# Altium schematic sheet 04. MCU + ANALOG.SchDoc
size A2
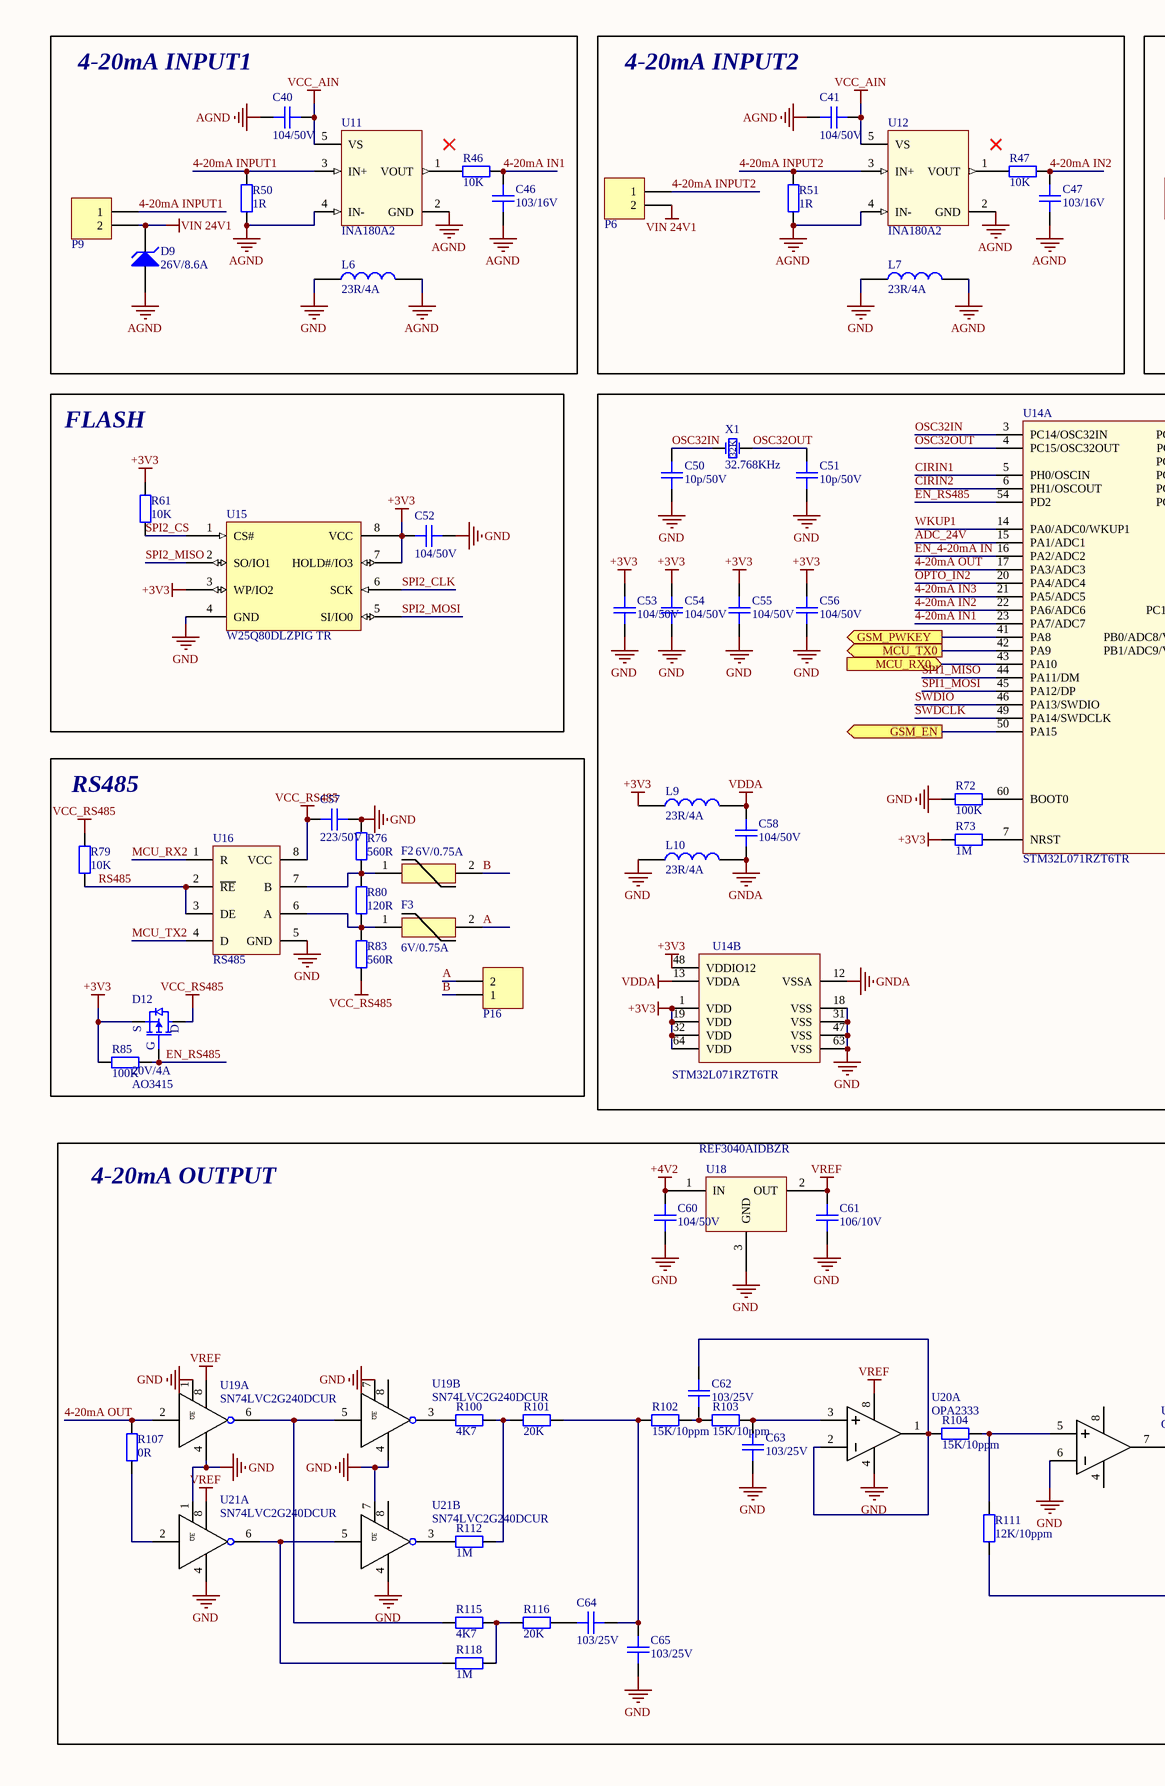
[diagram p0: 04. MCU + ANALOG.SchDoc, left]
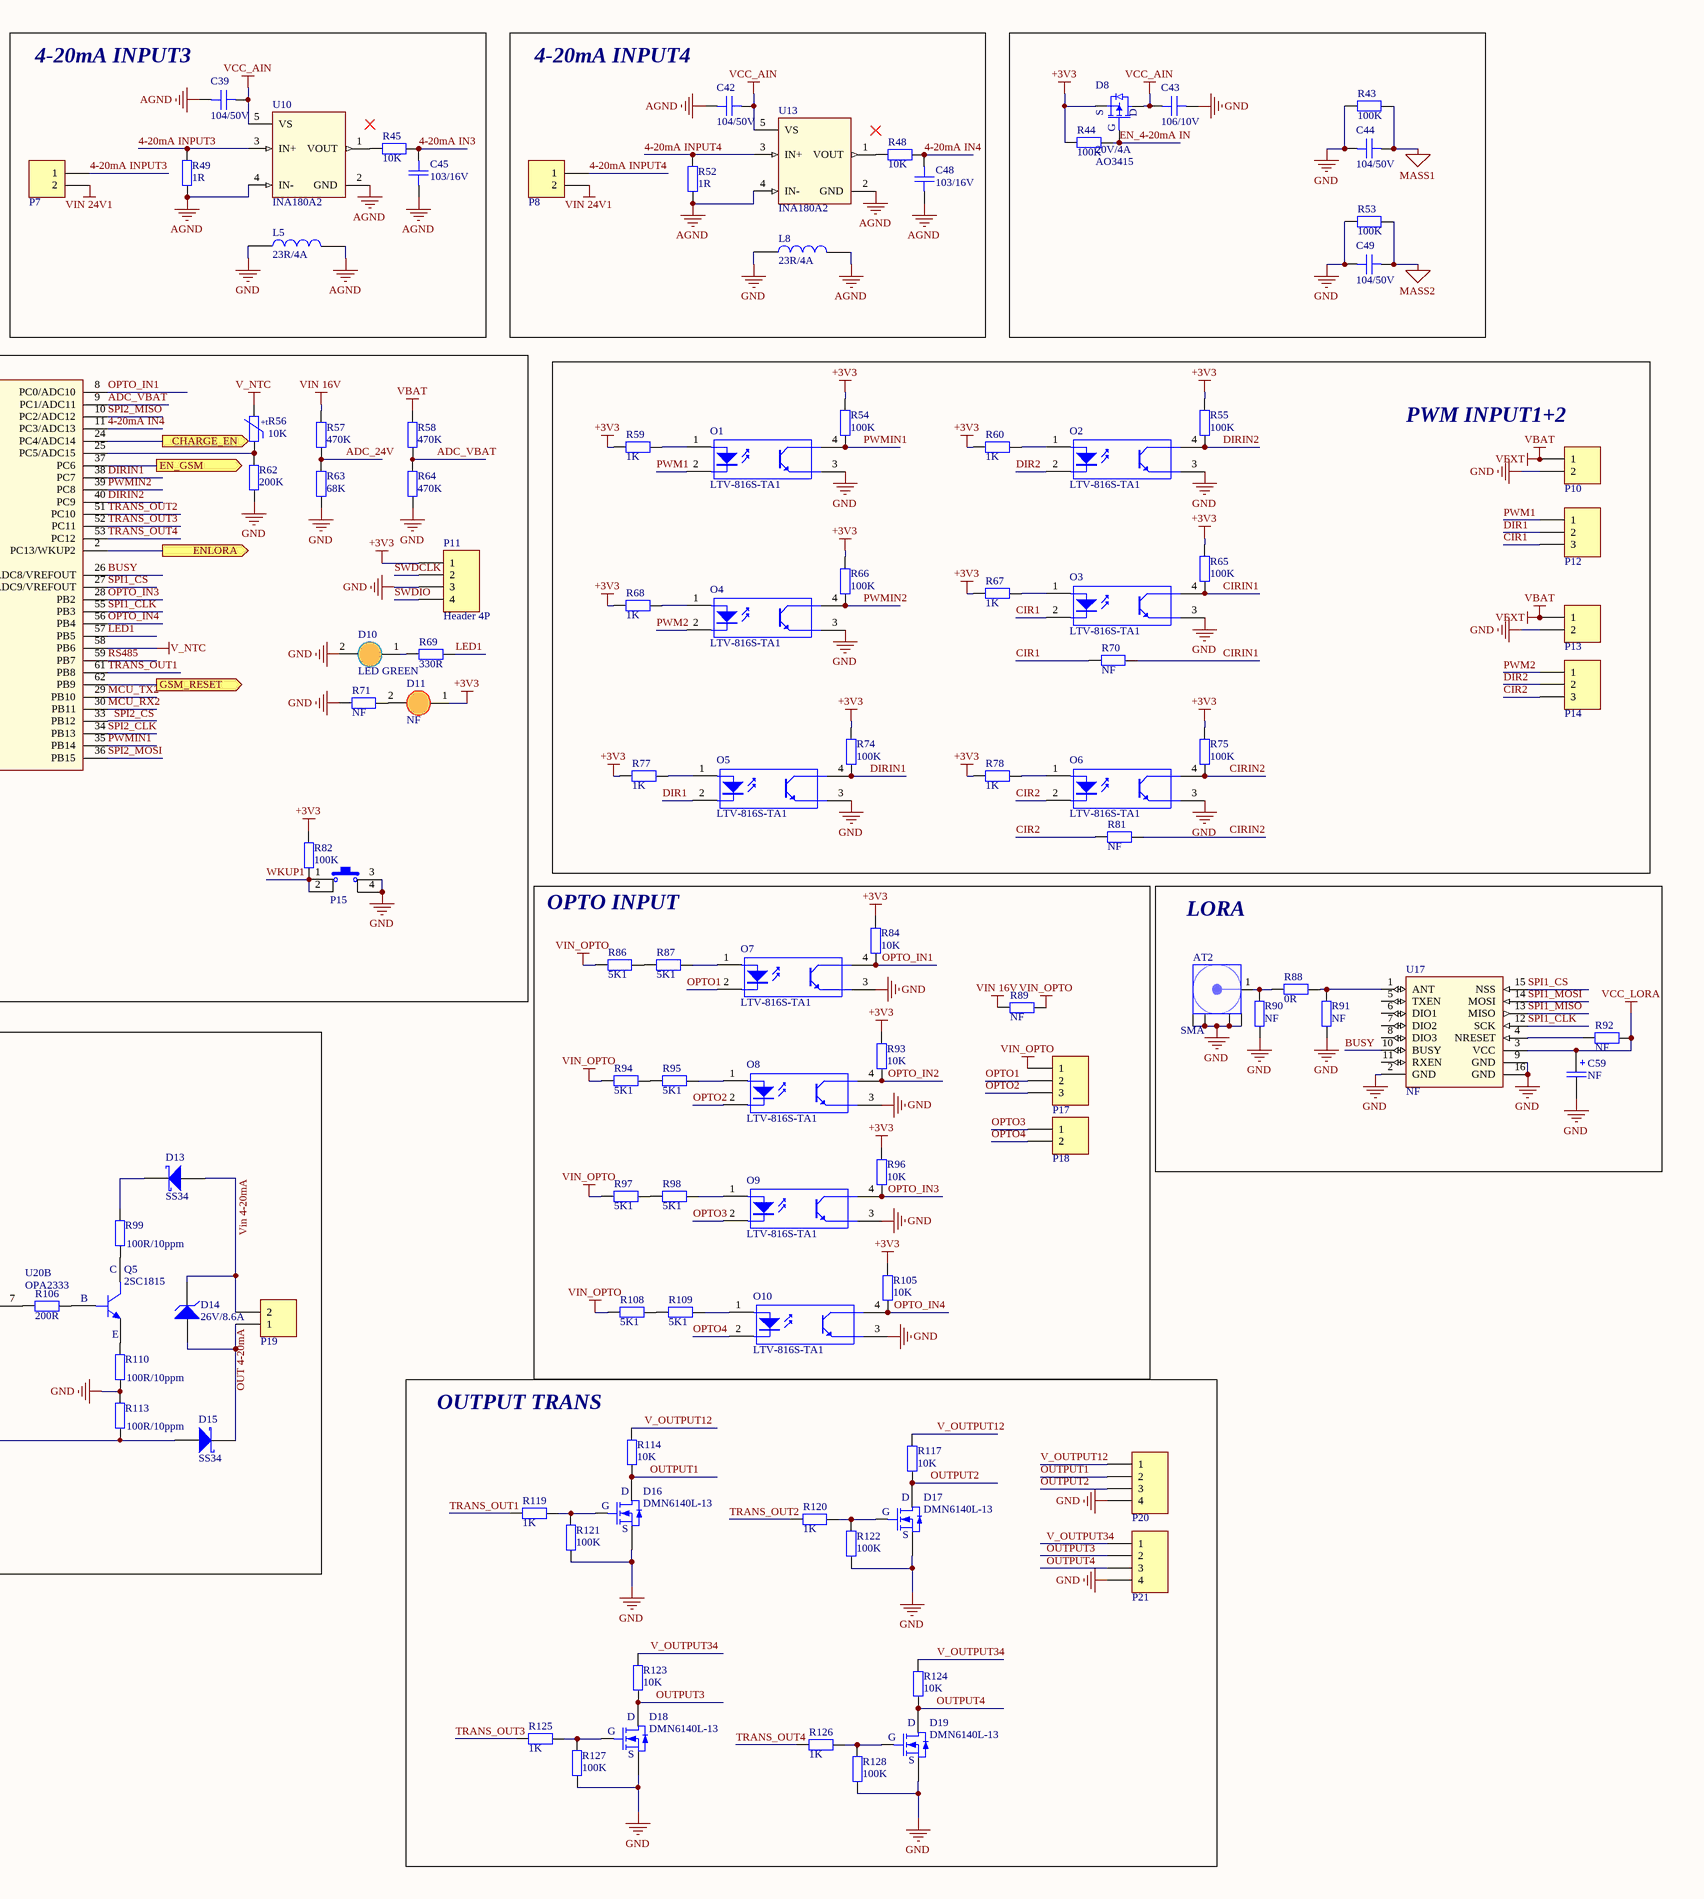
[diagram p1: 04. MCU + ANALOG.SchDoc, right]

## Parts
AT2  SMA  [SMA-KWE-17-V1]
C39  104/50V  [CAPC-0603 (1608)]
C40  104/50V  [CAPC-0603 (1608)]
C41  104/50V  [CAPC-0603 (1608)]
C42  104/50V  [CAPC-0603 (1608)]
C43  106/10V  [CAPC-0603 (1608)]
C44  104/50V  [CAPC-0603 (1608)]
C45  103/16V  [CAPC-0603 (1608)]
C46  103/16V  [CAPC-0603 (1608)]
C47  103/16V  [CAPC-0603 (1608)]
C48  103/16V  [CAPC-0603 (1608)]
C49  104/50V  [CAPC-0603 (1608)]
C50  10p/50V  [CAPC-0603 (1608)]
C51  10p/50V  [CAPC-0603 (1608)]
C52  104/50V  [CAPC-0603 (1608)]
C53  104/50V  [CAPC-0603 (1608)]
C54  104/50V  [CAPC-0603 (1608)]
C55  104/50V  [CAPC-0603 (1608)]
C56  104/50V  [CAPC-0603 (1608)]
C57  223/50V  [CAPC-0603 (1608)]
C58  104/50V  [CAPC-0603 (1608)]
C59  NF  [CAP_TANTAL_1210(3528)]
C60  104/50V  [CAPC-0603 (1608)]
C61  106/10V  [CAPC-0603 (1608)]
C62  103/25V  [CAPC-0603 (1608)]
C63  103/25V  [CAPC-0603 (1608)]
C64  103/25V  [CAPC-0603 (1608)]
C65  103/25V  [CAPC-0603 (1608)]
D8  20V/4A  [SOT23_3]
D9  26V/8.6A  [DIODE_DO214AC_SMA]
D10  LED GREEN  [LED_3MM-GREEN]
D11  NF  [LED_3MM-RED]
D12  20V/4A  [SOT23_3]
D13  SS34  [DIODE_DO214AC_SMA]
D14  26V/8.6A  [DIODE_DO214AC_SMA]
D15  SS34  [DIODE_DO214AC_SMA]
D16  DMN6140L-13  [SOT23_3]
D17  DMN6140L-13  [SOT23_3]
D18  DMN6140L-13  [SOT23_3]
D19  DMN6140L-13  [SOT23_3]
F2  6V/0.75A  [FUSE 0ZCK_BEL]
F3  6V/0.75A  [FUSE 0ZCK_BEL]
L5  23R/4A  [IND-0603 (1608)]
L6  23R/4A  [IND-0603 (1608)]
L7  23R/4A  [IND-0603 (1608)]
L8  23R/4A  [IND-0603 (1608)]
L9  23R/4A  [IND-0603 (1608)]
L10  23R/4A  [IND-0603 (1608)]
O1  LTV-816S-TA1  [OPTO 1]
O2  LTV-816S-TA1  [OPTO 1]
O3  LTV-816S-TA1  [OPTO 1]
O4  LTV-816S-TA1  [OPTO 1]
O5  LTV-816S-TA1  [OPTO 1]
O6  LTV-816S-TA1  [OPTO 1]
O7  LTV-816S-TA1  [OPTO 1]
O8  LTV-816S-TA1  [OPTO 1]
O9  LTV-816S-TA1  [OPTO 1]
O10  LTV-816S-TA1  [OPTO 1]
P6  15EDG3.81-2P  [HDR_3.81MM_RA_2x1]  (value not drawn)
P7  15EDG3.81-2P  [HDR_3.81MM_RA_2x1]  (value not drawn)
P8  15EDG3.81-2P  [HDR_3.81MM_RA_2x1]  (value not drawn)
P9  15EDG3.81-2P  [HDR_3.81MM_RA_2x1]  (value not drawn)
P10  15EDG3.81-2P  [HDR_3.81MM_RA_2x1]  (value not drawn)
P11  Header 4P  [HDR1X4]
P12  15EDG3.81-3P  [HDR_3.81MM_RA_3x1]  (value not drawn)
P13  15EDG3.81-2P  [HDR_3.81MM_RA_2x1]  (value not drawn)
P14  15EDG3.81-3P  [HDR_3.81MM_RA_3x1]  (value not drawn)
P15  (no value)  [BUTTON 4P_6X6]
P16  15EDG3.81-2P  [HDR_3.81MM_RA_2x1]  (value not drawn)
P17  15EDG3.81-3P  [HDR_3.81MM_RA_3x1]  (value not drawn)
P18  15EDG3.81-2P  [HDR_3.81MM_RA_2x1]  (value not drawn)
P19  15EDG3.81-2P  [HDR_3.81MM_RA_2x1]  (value not drawn)
P20  15EDG3.81-4P  [HDR_3.81MM_RA_4X1]  (value not drawn)
P21  15EDG3.81-4P  [HDR_3.81MM_RA_4X1]  (value not drawn)
Q5  2SC1815  [SOT23_3]
R43  100K  [RESC-0603 (1608)]
R44  100K  [RESC-0603 (1608)]
R45  10K  [RESC-0603 (1608)]
R46  10K  [RESC-0603 (1608)]
R47  10K  [RESC-0603 (1608)]
R48  10K  [RESC-0603 (1608)]
R49  1R  [RESC-0603 (1608)]
R50  1R  [RESC-0603 (1608)]
R51  1R  [RESC-0603 (1608)]
R52  1R  [RESC-0603 (1608)]
R53  100K  [RESC-0603 (1608)]
R54  100K  [RESC-0603 (1608)]
R55  100K  [RESC-0603 (1608)]
R56  10K  [RES NTC 10K]
R57  470K  [RESC-0603 (1608)]
R58  470K  [RESC-0603 (1608)]
R59  1K  [RESC-0603 (1608)]
R60  1K  [RESC-0603 (1608)]
R61  10K  [RESC-0603 (1608)]
R62  200K  [RESC-0603 (1608)]
R63  68K  [RESC-0603 (1608)]
R64  470K  [RESC-0603 (1608)]
R65  100K  [RESC-0603 (1608)]
R66  100K  [RESC-0603 (1608)]
R67  1K  [RESC-0603 (1608)]
R68  1K  [RESC-0603 (1608)]
R69  330R  [RESC-0603 (1608)]
R70  NF  [RESC-0603 (1608)]
R71  NF  [RESC-0603 (1608)]
R72  100K  [RESC-0603 (1608)]
R73  1M  [RESC-0603 (1608)]
R74  100K  [RESC-0603 (1608)]
R75  100K  [RESC-0603 (1608)]
R76  560R  [RESC-0603 (1608)]
R77  1K  [RESC-0603 (1608)]
R78  1K  [RESC-0603 (1608)]
R79  10K  [RESC-0603 (1608)]
R80  120R  [RESC-0603 (1608)]
R81  NF  [RESC-0603 (1608)]
R82  100K  [RESC-0603 (1608)]
R83  560R  [RESC-0603 (1608)]
R84  10K  [RESC-0603 (1608)]
R85  100K  [RESC-0603 (1608)]
R86  5K1  [RESC-0603 (1608)]
R87  5K1  [RESC-0603 (1608)]
R88  0R  [RESC-0603 (1608)]
R89  NF  [RESC-0603 (1608)]
R90  NF  [RESC-0603 (1608)]
R91  NF  [RESC-0603 (1608)]
R92  NF  [RESC-0603 (1608)]
R93  10K  [RESC-0603 (1608)]
R94  5K1  [RESC-0603 (1608)]
R95  5K1  [RESC-0603 (1608)]
R96  10K  [RESC-0603 (1608)]
R97  5K1  [RESC-0603 (1608)]
R98  5K1  [RESC-0603 (1608)]
R99  100R/10ppm  [RESC-0805 (2012)]
R100  4K7  [RESC-0603 (1608)]
R101  20K  [RESC-0603 (1608)]
R102  15K/10ppm  [RESC-0603 (1608)]
R103  15K/10ppm  [RESC-0603 (1608)]
R104  15K/10ppm  [RESC-0603 (1608)]
R105  10K  [RESC-0603 (1608)]
R106  200R  [RESC-0603 (1608)]
R107  0R  [RESC-0603 (1608)]
R108  5K1  [RESC-0603 (1608)]
R109  5K1  [RESC-0603 (1608)]
R110  100R/10ppm  [RESC-0805 (2012)]
R111  12K/10ppm  [RESC-0603 (1608)]
R112  1M  [RESC-0603 (1608)]
R113  100R/10ppm  [RESC-0805 (2012)]
R114  10K  [RESC-0603 (1608)]
R115  4K7  [RESC-0603 (1608)]
R116  20K  [RESC-0603 (1608)]
R117  10K  [RESC-0603 (1608)]
R118  1M  [RESC-0603 (1608)]
R119  1K  [RESC-0603 (1608)]
R120  1K  [RESC-0603 (1608)]
R121  100K  [RESC-0603 (1608)]
R122  100K  [RESC-0603 (1608)]
R123  10K  [RESC-0603 (1608)]
R124  10K  [RESC-0603 (1608)]
R125  1K  [RESC-0603 (1608)]
R126  1K  [RESC-0603 (1608)]
R127  100K  [RESC-0603 (1608)]
R128  100K  [RESC-0603 (1608)]
U10  INA180A2  [SOT23-5]
U11  INA180A2  [SOT23-5]
U12  INA180A2  [SOT23-5]
U13  INA180A2  [SOT23-5]
U14  STM32L071RZT6TR  [LQFP-64]  (parts A,B of 2)
U15  W25Q80DLZPIG TR  [WSON-8 6X5MM]
U16  RS485  [SOIC8]
U17  NF  [Lora1276 V1.2]
U18  REF3040AIDBZR  [SOT23_3]
U19  SN74LVC2G240DCUR  [SN74LVC2G240DCUR]  (parts A,B of 2)
U20  OPA2333  [8VSSOP]  (parts A,B of 2)
U21  SN74LVC2G240DCUR  [SN74LVC2G240DCUR]  (parts A,B of 2)
X1  32.768KHz  [CRYSTAL_ABS06 2x1.2mm]

## Blocks framed on the sheet
4-20mA INPUT1: C40 C46 D9 L6 P9 R46 R50 U11
4-20mA INPUT2: C41 C47 L7 P6 R47 R51 U12
4-20mA INPUT3: C39 C45 L5 P7 R45 R49 U10
4-20mA INPUT4: C42 C48 L8 P8 R48 R52 U13
FLASH: C52 R61 U15
PWM INPUT1+2: O1-O6 P10 P12-P14 R54 R55 R59 R60 R65-R68 R70 R74 R75 R77 R78 R81
RS485: C57 D12 F2 F3 P16 R76 R79 R80 R83 R85 U16
OPTO INPUT: O7-O10 P17 P18 R84 R86 R87 R89 R93-R98 R105 R108 R109
LORA: AT2 C59 R88 R90-R92 U17
4-20mA OUTPUT: C60-C65 D13-D15 P19 Q5 R99-R104 R106 R107 R110-R113 R115 R116 R118 U18-U21
OUTPUT TRANS: D16-D19 P20 P21 R114 R117 R119-R128

## Ports
CHARGE_EN (out), EN_GSM (out), ENLORA (out), GSM_EN (out), GSM_PWKEY (out), GSM_RESET (out), MCU_RX0 (in), MCU_TX0 (out)

## Nets
+3V3: C52.2 C53.2 C54.2 C55.2 C56.2 D8.2(S) D11.1(A) D12.2(S) L9.1 P11.1 R44.2 R54.2 R55.2 R59.1 R60.1 R61.1 R65.2 R66.2 R67.1 R68.1 R73.1 R74.2 R75.2 R77.1 R78.1 R82.2 R84.2 R85.2 R93.2 R96.2 R105.2 U14.1(VDD) U14.19(VDD) U14.32(VDD) U14.48(VDDIO12) U14.64(VDD) U15.3(WP/IO2) U15.7(HOLD#/IO3) U15.8(VCC)
+4V2: C60.2 U18.1(IN)
AGND: C39.2 C40.2 C41.2 C42.2 C45.1 C46.1 C47.1 C48.1 D9.1(A) L5.2 L6.2 L7.2 L8.2 R49.1 R50.1 R51.1 R52.1 U10.2(GND) U10.4(IN-) U11.2(GND) U11.4(IN-) U12.2(GND) U12.4(IN-) U13.2(GND) U13.4(IN-)
GND: AT2.2 C43.2 C44.1 C49.1 C50.1 C51.1 C52.1 C53.1 C54.1 C55.1 C56.1 C57.2 C59.2 C60.1 C61.2 C63.2 C65.2 D10.2(K) D16.2(S) D17.2(S) D18.2(S) D19.2(S) L5.1 L6.1 L7.1 L8.1 L10.1 O1.3 O2.3 O3.3 O4.3 O5.3 O6.3 O7.3 O8.3 O9.3 O10.3 P10.2 P11.3 P13.2 P15.3 P15.4 P20.4 P21.4 R43.1 R53.1 R62.1 R63.1 R64.1 R71.1 R72.1 R76.2 R90.1 R91.1 R110.1 R113.2 R121.1 R122.1 R127.1 R128.1 U14.18(VSS) U14.31(VSS) U14.47(VSS) U14.63(VSS) U15.4(GND) U16.5(GND) U17.2(GND) U17.9(GND) U17.16(GND) U18.3(GND) U19.1(~{OE}) U19.4(GND) U19.7(~{OE}) U20.4(VSS) U20.6(IN-) U21.1(~{OE}) U21.4(GND) U21.7(~{OE})
GNDA: C58.1 L10.2 U14.12(VSSA)
MASS1: C44.2 R43.2
MASS2: C49.2 R53.2
V_NTC: R56.2 U14.58(PB6)
VBAT: P10.1 P13.1 R58.2  [also labelled VEXT]
VCC_AIN: C39.1 C40.1 C41.1 C42.1 C43.1 D8.3(D) U10.5(VS) U11.5(VS) U12.5(VS) U13.5(VS)
VCC_LORA: C59.1 R92.2 U17.3(VCC)
VCC_RS485: C57.1 D12.3(D) R79.2 R83.1 U16.8(VCC)
VDDA: C58.2 L9.2 U14.13(VDDA)
VIN 16V: R57.2 R89.1
VIN 24V1: D9.2(K) P6.2 P7.2 P8.2 P9.2
VIN_OPTO: P17.1 R86.1 R89.2 R94.1 R97.1 R108.1
VREF: C61.1 U18.2(OUT) U19.8(VCC) U20.8(VCC) U21.8(VCC)
4-20mA IN1: C46.2 R46.1 U14.23(PA7/ADC7)
4-20mA IN2: C47.2 R47.1 U14.22(PA6/ADC6)
4-20mA IN3: C45.2 R45.1 U14.21(PA5/ADC5)
4-20mA IN4: C48.2 R48.1 U14.11(PC3/ADC13)
4-20mA INPUT1: P9.1 R50.2 U11.3(IN+)
4-20mA INPUT2: P6.1 R51.2 U12.3(IN+)
4-20mA INPUT3: P7.1 R49.2 U10.3(IN+)
4-20mA INPUT4: P8.1 R52.2 U13.3(IN+)
4-20mA OUT: R107.2 U14.17(PA3/ADC3) U19.2(A)
A: F3.2 P16.2
ADC_24V: R57.1 R63.2 U14.15(PA1/ADC1)
ADC_VBAT: R58.1 R64.2 U14.9(PC1/ADC11)
B: F2.2 P16.1
BUSY: U14.26(PB0/ADC8/VREFOUT) U17.10(BUSY)
CHARGE_EN: U14.24(PC4/ADC14) ; port CHARGE_EN
CIR1: O3.2 P12.3 R70.1
CIR2: O6.2 P14.3 R81.1
CIRIN1: O3.4 R65.1 R70.2 U14.5(PH0/OSCIN)
CIRIN2: O6.4 R75.1 R81.2 U14.6(PH1/OSCOUT)
DIR1: O5.2 P12.2
DIR2: O2.2 P14.2
DIRIN1: O5.4 R74.1 U14.38(PC7)
DIRIN2: O2.4 R55.1 U14.40(PC9)
EN_4-20mA IN: D8.1(G) R44.1 U14.16(PA2/ADC2)
EN_GSM: U14.37(PC6) ; port EN_GSM
EN_RS485: D12.1(G) R85.1 U14.54(PD2)
ENLORA: U14.2(PC13/WKUP2) ; port ENLORA
GSM_EN: U14.50(PA15) ; port GSM_EN
GSM_PWKEY: U14.41(PA8) ; port GSM_PWKEY
GSM_RESET: U14.62(PB9) ; port GSM_RESET
LED1: R69.2 U14.57(PB5)
MCU_RX0: U14.43(PA10) ; port MCU_RX0
MCU_RX2: U14.30(PB11) U16.1(R)
MCU_TX0: U14.42(PA9) ; port MCU_TX0
MCU_TX2: U14.29(PB10) U16.4(D)
OPTO1: O7.2 P17.2
OPTO2: O8.2 P17.3
OPTO3: O9.2 P18.1
OPTO4: O10.2 P18.2
OPTO_IN1: O7.4 R84.1 U14.8(PC0/ADC10)
OPTO_IN2: O8.4 R93.1 U14.20(PA4/ADC4)
OPTO_IN3: O9.4 R96.1 U14.28(PB2)
OPTO_IN4: O10.4 R105.1 U14.56(PB4)
OSC32IN: C50.2 U14.3(PC14/OSC32IN) X1.1(OSC1)
OSC32OUT: C51.2 U14.4(PC15/OSC32OUT) X1.2(OSC2)
OUTPUT1: D16.3(D) P20.2 R114.1
OUTPUT2: D17.3(D) P20.3 R117.1
OUTPUT3: D18.3(D) P21.2 R123.1
OUTPUT4: D19.3(D) P21.3 R124.1
PWM1: O1.2 P12.1
PWM2: O4.2 P14.1
PWMIN1: O1.4 R54.1 U14.35(PB14)
PWMIN2: O4.4 R66.1 U14.39(PC8)
RS485: R79.1 U14.59(PB7) U16.2(~{RE}) U16.3(DE)
SPI1_CLK: U14.55(PB3) U17.12(SCK)
SPI1_CS: U14.27(PB1/ADC9/VREFOUT) U17.15(NSS)
SPI1_MISO: U14.44(PA11/DM) U17.13(MISO)
SPI1_MOSI: U14.45(PA12/DP) U17.14(MOSI)
SPI2_CLK: U14.34(PB13) U15.6(SCK)
SPI2_CS: R61.2 U14.33(PB12) U15.1(CS#)
SPI2_MISO: U14.10(PC2/ADC12) U15.2(SO/IO1)
SPI2_MOSI: U14.36(PB15) U15.5(SI/IO0)
SWDCLK: P11.2 U14.49(PA14/SWDCLK)
SWDIO: P11.4 U14.46(PA13/SWDIO)
TRANS_OUT1: R119.1 U14.61(PB8)
TRANS_OUT2: R120.1 U14.51(PC10)
TRANS_OUT3: R125.1 U14.52(PC11)
TRANS_OUT4: R126.1 U14.53(PC12)
V_OUTPUT12: P20.1 R114.2 R117.2
V_OUTPUT34: P21.1 R123.2 R124.2
Vin 4-20mA: D13.1(A) D14.2(K) P19.2
WKUP1: P15.1 P15.2 R82.1 U14.14(PA0/ADC0/WKUP1)
NetAT2_1: AT2.1(Signal) R88.2 R90.2
NetC62_1: C62.1 R102.2 R103.1
NetC62_2: C62.2 R104.1 U20.1(OUT) U20.2(IN-)
NetC63_1: C63.1 R103.2 U20.3(IN+)
NetC64_1: C64.1 C65.1 R101.2 R102.1
NetC64_2: C64.2 R116.2
NetD10_1: D10.1(A) R69.1
NetD11_2: D11.2(K) R71.2
NetD13_2: D13.2(K) R99.2
NetD14_1: D14.1(A) D15.2(K) P19.1
NetD15_1: D15.1(A) R111.1 R113.1
NetD16_1: D16.1(G) R119.2 R121.2
NetD17_1: D17.1(G) R120.2 R122.2
NetD18_1: D18.1(G) R125.2 R127.2
NetD19_1: D19.1(G) R126.2 R128.2
NetF2_1: F2.1 R76.1 R80.2 U16.7(B)
NetF3_1: F3.1 R80.1 R83.2 U16.6(A)
NetO1_1: O1.1 R59.2
NetO2_1: O2.1 R60.2
NetO3_1: O3.1 R67.2
NetO4_1: O4.1 R68.2
NetO5_1: O5.1 R77.2
NetO6_1: O6.1 R78.2
NetO7_1: O7.1 R87.2
NetO8_1: O8.1 R95.2
NetO9_1: O9.1 R98.2
NetO10_1: O10.1 R109.2
NetQ5_1: Q5.1(B) R106.2
NetQ5_2: Q5.2(E) R110.2
NetQ5_3: Q5.3(C) R99.1
NetR45_2: R45.2 U10.1(VOUT)
NetR46_2: R46.2 U11.1(VOUT)
NetR47_2: R47.2 U12.1(VOUT)
NetR48_2: R48.2 U13.1(VOUT)
NetR56_1: R56.1 R62.2 U14.25(PC5/ADC15)
NetR72_2: R72.2 U14.60(BOOT0)
NetR73_2: R73.2 U14.7(NRST)
NetR86_2: R86.2 R87.1
NetR88_1: R88.1 R91.2 U17.1(ANT)
NetR92_1: R92.1 U17.4(NRESET)
NetR94_2: R94.2 R95.1
NetR97_2: R97.2 R98.1
NetR100_1: R100.1 U19.3(Y)
NetR100_2: R100.2 R101.1 R112.2
NetR104_2: R104.2 R111.2 U20.5(IN+)
NetR106_1: R106.1 U20.7(OUT)
NetR107_1: R107.1 U21.2(A)
NetR108_2: R108.2 R109.1
NetR112_1: R112.1 U21.3(Y)
NetR115_1: R115.1 U19.5(A) U19.6(Y)
NetR115_2: R115.2 R116.1 R118.2
NetR118_1: R118.1 U21.5(A) U21.6(Y)

Not connected (* = marked no-connect by the designer): U17 5(TXEN) 6(DIO1) 7(DIO2) 8(DIO3) 11(RXEN)

## Notes on the sheet
- Labels drawn without touching a wire or pin: OUT 4-20mA
- File:
- Project:
- REV:
- Sheet:
- Drawn By:
- Size:
- A2
- DRAFT
- Checked By:
- Approved By:
- (in symbol 01M1002JF) +t
- (in symbol ABS06-107-32.768kHz-T) 32K

## Library data of the parts
AT2 = GKZS-SMAJZM-KWE-17.3: MFR: GAOKE; Solder: WAVE; MPN: GKZS-SMAJZM-KWE-17.3; Value: SMA
C39-C42 C44 C49 C52-C56 C58 C60 = C0603C104K5RACTU: CAP CER 0.1uF 50V 10% X7R 0603; Solder: SMT; Company ID: VT00574; MPN: C0603C104K5RACTU; Value: 104/50V
C43 C61 = CL10A106KP8NNNC: CAP CER 10uF 10% 10V X5R 0603; Solder: SMT; MPN: CL10A106KP8NNNC; Value: 106/10V
C45-C48 = CC0603KRX7R7BB103: CAP CER 10nF 16V 10% X7R 0603; Solder: SMT; Company ID: VT00031; MPN: CC0603KRX7R7BB103; Value: 103/16V
C50 C51 = CL10C100JB8NNND: CAP CER 10pF 5% 50V NP0 0603; Solder: SMT; Company ID: VT00076; Value: 10p/50V; MPN: CL10C100JB8NNND
C57 = CC0603JRX7R9BB223: CAP CER 0.022uF 5% 50V X7R 0603; Solder: SMT; MPN: CC0603JRX7R9BB223; Value: 223/50V
C59 = T520B227M006ATE035: CAP TANT POLY 220uF 20% 6.3V 3528 35mOhm ESR; Solder: SMT; Value: 227/6.3V; Company ID: VT00099; MPN: T520B227M006ATE035
C62-C65 = GMC10CG103J25NT: CAP CER 0.01UF 25V C0G/NP0 0603; MFR: CAL-CHIP ELECTRONICS, INC.; MPN: GMC10CG103J25NT; Solder: Cap-0603; Value: 103/25V; Category: Capacitor; Company ID: *
D8 D12 = AO3415: MOSFET P-CH 20V 4A SOT23; MFR: Alpha & Omega Semiconductor Inc.; Company ID: VT00490; CATEGORY: DIODE; SOLDER: SOT23; VALUE: 20V/4A; MPN: AO3415
D9 D14 = P4SMAJ26: TVS DIODE 26VWM 46.6VC SMA/DO214; MFR: Diotec Semiconductor; Solder: SMT; Value: 26V/8.6A; MPN: P4SMAJ26; Category: Diode
D10 = OVLBG4C7: LED GREEN CLEAR 3MM ROUND T/H; Solder: WAVE; MPN: OVLBG4C7; Value: LED GREEN
D11 = WP710A10SRC/E: LED RED CLEAR 3MM ROUND T/H; Solder: WAVE; Value: LED RED; MPN: WP710A10SRC/E
D13 D15 = SS34: DIODE SCHOTTKY 40V 3A SMA; MFR: onsemi; Solder: SMT; Company ID: VT00542; MPN: SS34; Value: SS34
D16-D19 = DMN6140L-13: MOSFET N-CH 60V 1.6A SOT23; MFR: Diodes Incorporated; Company ID: VT00176; MPN: DMN6140L-13; Category: MOSFET; Solder: SOT23
F2 F3 = 0ZCK0075FF2E: PTC RESET FUSE 6V 750MA 0805; Manufacturer: Bel Fuse Inc.; Solder: SMT; MPN: 0ZCK0075FF2E; Category: Fuse; Value: 6V/0.75A
L5-L10 = FBMJ1608HM230NT: IND-FERRITE BEAD 23 OHM  4A 0603 1LN; Solder: SMT; Company ID: VT00326; MPN: FBMJ1608HM230NT; Value: 23R/4A
O1-O10 = LTV-816S-TA1: OPTOISOLATR 5KV TRANSISTOR 4-SMD; MFR: Lite-On Inc.; Solder: SMD 4P; MPN: LTV-816S-TA1; Value: LTV-816S-TA1; Category: Opto
P6-P10 P13 P16 P18 P19 = 15EDG3.81-2P: Pluggable terminal 15EDG- 2P 3.81MM; MFR: China; Solder: Hand; MPN: 15EDG3.81-2P; Value: 15EDG3.81-2P; Company ID: *; MPN2: CLA5048
P11 = Header 4x1: Header, 4 Pin Pitch 2.54mm; MPN: S1012EC-40-ND; Company ID: VT-00125; Solder: WAVE; Value: Header 4P
P12 P14 P17 = 15EDG3.81-3P: Pluggable terminal 15EDG- 3P 3.81MM; MFR: China; Solder: Hand; MPN: 15EDG3.81-3P; Value: 15EDG3.81-3P; Company ID: *; MPN2: CLA5050
P15 = Button 4P: MPN: CLA1773; MFR: China Brand; Solder: Wave; Company ID: VT00544; Category: Button
P20 P21 = 15EDG3.81-4P: Pluggable terminal 15EDG- 4P 3.81MM; MFR: China; Solder: Hand; MPN: 15EDG3.81-4P; Value: 15EDG3.81-4P; Company ID: *; MPN2: CLA5052
Q5 = 2SC1815: TRANS NPN 50V 0.15A SOT23-3; Solder: SMT; Company ID: VT00492; MPN: 2SC1815; Value: 2SC1815; Category: Transistor
R43 R44 R53-R55 R65 R66 R72 R74 R75 R82 R85 R121 R122 R127 R128 = RC0603FR-07100KL: RES SMD 100K OHM 1% 1/10W 0603; Solder: SMT; Company ID: VT00424; MPN: RC0603FR-07100KL; Value: 100K
R45-R48 R61 R79 R84 R92 R93 R96 R105 R114 R117 R123 R124 = RC0603FR-0710KL: RES SMD 10K OHM 1% 1/10W 0603; Solder: SMT; Company ID: VT00426; MPN: RC0603FR-0710KL; Value: 10K
R49-R52 = TNPW06031R00DEEA: RES 1 OHM 0.5% 1/8W 0603; Solder: SMT; Temperature Coefficient: 25ppm/C; MPN: TNPW06031R00DEEA; Value: 1R
R56 = 01M1002JF: THERMISTOR NTC 10KOHM 3964K BEAD; MFR: Vishay; Solder: Wave; MPN: 01M1002JF; Value: 10K; Category: RESISTOR
R57 R58 R64 = RC0603FR-07470KL: RES SMD 470K OHM 1% 1/10W 0603; Solder: SMT; Company ID: VT00448; Value: 470K; MPN: RC0603FR-07470K
R59 R60 R67 R68 R77 R78 R119 R120 R125 R126 = RC0603FR-071KL: RES SMD 1 KOHM 1% 1/10W 0603; Solder: SMT; Company ID: VT00433; MPN: RC0603FR-071KL; Value: 1K
R62 = CR0603-FX-2003ELF: RES SMD 200K OHM 1% 1/10W 0603; MPN: CR0603-FX-2003ELF; VALUE: 200K; Category: Resistor
R63 = CRCW060368K0FKEA: RES SMD 68K OHM 1% 1/10W 0603; Solder: SMT; MPN: CRCW060368K0FKEA; Value: 68K
R69 = RC0603FR-07330RL: RES SMD 330 OHM 1% 1/10W 0603; Solder: SMT; Company ID: VT00443; Value: 330R; MPN: RC0603FR-07330RL
R70 R81 R89 = RC0603FR-070R: RES SMD 0 OHM 1% 1/10W 0603; Solder: SMT; Value: 0R; Company ID: VT00423; MPN: RC0603FR-070R
R71 = RC0603FR-07180RL: RES SMD 180 OHM 1% 1/10W 0603; Value: 180R; Solder: SMT; Company ID: VT00430; MPN: RC0603FR-07180RL
R73 = CRCW06031M00FKEA: RES SMD 1M OHM 1% 1/10W 0603; Solder: SMT; Company ID: VT00405; MPN: CRCW06031M00FKEA; Value: 1M
R76 R83 = RC0603FR-07560RL: RES SMD 560 OHM 1% 1/10W 0603; Solder: SMT; Company ID: VT00455; MPN: RC0603FR-07560RL; Value: 560R
R80 = RC0603FR-07120RL: RES SMD 120 OHM 1% 1/10W 0603; Solder: SMT; Company ID: VT00427; MPN: RC0603FR-07120RL; Value: 120R
R86 R87 R94 R95 R97 R98 R108 R109 = RC0603FR-075K1L: RES SMD 5.1K OHM 1% 1/10W 0603; MFR: Yageo; Company ID: VT00457; MPN: RC0603FR-075K1L; CATEGORY: RESISTOR; VALUE: 5K1
R88 = RC0603FR-070RL: RES SMD 0.0OHM JUMPER 1/10W 0603; Solder: SMT; Company ID: VT00423; MPN: RC0603FR-070RL; Value: 0R
R90 R91 = RC0603FR-070RL: RES SMD 0.0OHM JUMPER 1/10W 0603; Value: 0R; Solder: SMT; Company ID: VT00423; MPN: RC0603FR-070RL
R99 R110 R113 = RT0805BRB07100RL: RES SMD 100 OHM 0.1% 1/8W 0805; MFR: Yageo; Solder: RES-0805; MPN: RT0805BRB07100RL; Value: 100R/10ppm; Category: Resistor; Company ID: *
R100 R115 = RC0603FR-074K7L: RES SMD 4.7K OHM 1% 1/10W 0603; Solder: SMT; Company ID: VT00451; MPN: RC0603FR-074K7L; Value: 4K7
R101 R116 = RC0603FR-0720KL: RES SMD 20K OHM 1% 1/10W 0603; Solder: SMT; Company ID: VT00436; MPN: RC0603FR-0720KL; Value: 20K
R102-R104 = RT0603BRB0715KL: RES SMD 15K OHM 0.1% 1/10W 0603 10PPM; MFR: Yageo; Value: 15K/10ppm; MPN: RT0603BRB0715KL; CATEGORY: RESISTOR; SOLDER: RES-0603; COMPANY ID: *
R106 = AC0603FR-07200RL: RES SMD 200 OHM 1% 1/10W 0603; MFR: YAGEO; MPN: AC0603FR-07200RL; CATEGORY: RESISTOR; SOLDER: RES-0603; Value: 200R; COMPANY ID: *
R107 = RC0603FR-070RL: RES SMD 0.0OHM JUMPER 1/10W 0603; MFR: Yageo; Solder: SMT; Company ID: VT00423; MPN: RC0603FR-070RL; Value: 0R; Category: Resistor
R111 = TNPW060312K0BYEN: RES 12K OHM 0.1% 1/8W 0603; MFR: Vishay Dale; Solder: SMT; MPN: TNPW060312K0BYEN; Value: 12K/10ppm; Category: RESISTOR
R112 R118 = CRCW06031M00FKEA: RES SMD 1M OHM 1% 1/10W 0603; MFR: Vishay Dale; Solder: SMT; Company ID: VT00405; MPN: CRCW06031M00FKEA; Value: 1M; Category: Resistor
U10-U13 = INA180A2IDBVT: IC CURR SENSE 1 CIRCUIT SOT23-5; MFR: TI; MPN: INA180A2IDBVT; Category: IC; Solder: SOT23-5; Company ID: *; Value: INA180A2
U14 = STM32L071RZT6TR: IC MCU 32BIT 192KB FLASH 64LQFP; MFR: ST; MPN: STM32L071RZT6TR; CATEGORY: IC; SOLDER: 64 LQFP; Value: STM32L071RZT6TR; COMPANY ID: *
U15 = W25Q80DLZPIG TR: IC FLSH 8MBIT SPI/QUAD I/O 8WSON; MFR: Winbond Electronics; Solder: SMT; MPN: W25Q80DLZPIG TR; Value: W25Q80DLZPIG TR; Category: IC; Company ID: *
U16 = SN65HVD72DR: IC TRANSCEIVER HALF 1/1 8SOIC; MFR: TI; SOLDER: SOIC-8; MPN: SN65HVD72DR; CATEGORY: IC; VALUE: RS485
U17 = RA-01S: Module lora RA-01S SX1268; MFR: AI-THINKER; Solder: SMT 16; MPN: RA-01S; Category: Module; Value: RA-01S
U18 = REF3040AIDBZR: IC VREF SHUNT ADJ SOT23-3; MFR: TI; Solder: SOT-23; MPN: REF3040AIDBZR; Value: REF3040AIDBZR; Category: IC; Company ID: *
U19 U21 = SN74LVC2G240DCUR: 2-ch, 1.65-V to 5.5-V inverters with 3-state outputs; MFR: TI; Solder: VSSOP; MPN: SN74LVC2G240DCUR; Category: IC; Value: SN74LVC2G240DCUR
U20 = OPA2333AIDGKR: OPA2333 1.8V, 17A, 2 CHANNELS, M; MFR: TI; Solder: VSSOP-8; MPN: OPA2333AIDGKR; Category: IC; Value: OPA2333; Company ID: *
X1 = ABS06-107-32.768kHz-T: CRYSTAL 32.7680KHZ 4pF SMD; Solder: SMT; Company ID: VT00159; Value: 32.768KHz; MPN: ABS06-107-32.768kHz-T